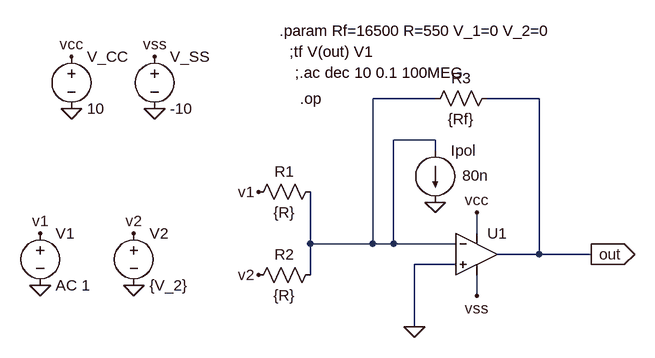
[diagram p0: schematic LAB2.asc]
LAB2.asc, the LTspice schematic file:
Version 4
SHEET 1 880 680
WIRE 336 0 240 0
WIRE 496 0 416 0
WIRE 336 64 272 64
WIRE 336 80 336 64
WIRE 400 208 400 176
WIRE 144 224 144 144
WIRE 240 224 240 0
WIRE 240 224 144 224
WIRE 272 224 272 64
WIRE 272 224 240 224
WIRE 368 224 272 224
WIRE 496 240 496 0
WIRE 496 240 432 240
WIRE 576 240 496 240
WIRE 368 256 304 256
WIRE 144 272 144 224
WIRE 400 304 400 272
WIRE 304 352 304 256
FLAG -272 288 0
FLAG -128 288 0
FLAG -224 16 0
FLAG -96 16 0
FLAG -224 -64 vcc
FLAG 400 176 vcc
FLAG -96 -64 vss
FLAG 400 304 vss
FLAG -272 208 v1
FLAG 64 144 v1
FLAG -128 208 v2
FLAG 64 272 v2
FLAG 304 352 0
FLAG 576 240 out
IOPIN 576 240 Out
FLAG 336 160 0
DATAFLAG 496 240 ""
SYMBOL res 160 128 R90
WINDOW 0 0 56 VBottom 2
WINDOW 3 32 56 VTop 2
SYMATTR InstName R1
SYMATTR Value {R}
SYMBOL res 160 256 R90
WINDOW 0 0 56 VBottom 2
WINDOW 3 32 56 VTop 2
SYMATTR InstName R2
SYMATTR Value {R}
SYMBOL res 432 -16 R90
WINDOW 0 0 56 VBottom 2
WINDOW 3 32 56 VTop 2
SYMATTR InstName R3
SYMATTR Value {Rf}
SYMBOL OpAmps\\UniversalOpamp2 400 240 R0
SYMATTR InstName U1
SYMATTR Value2 Avol=1Meg GBW=(1Meg) Slew=500k
SYMATTR SpiceLine ilimit=25m rail=0 Vos=0
SYMBOL voltage -224 -80 R0
SYMATTR InstName V_CC
SYMATTR Value 10
SYMBOL voltage -96 -80 R0
SYMATTR InstName V_SS
SYMATTR Value -10
SYMBOL voltage -272 192 R0
WINDOW 123 0 0 Left 0
WINDOW 39 0 0 Left 0
SYMATTR InstName V1
SYMATTR Value AC 1
SYMBOL voltage -128 192 R0
SYMATTR InstName V2
SYMATTR Value {V_2}
SYMBOL current 336 80 R0
WINDOW 3 42 39 Left 2
SYMATTR InstName Ipol
SYMATTR Value 80n
TEXT 96 -104 Left 2 !.param Rf=16500 R=550 V_1=0 V_2=0
TEXT 112 -72 Left 2 !;tf V(out) V1
TEXT 120 -40 Left 2 !;.ac dec 10 0.1 100MEG
TEXT 128 0 Left 2 !.op

The netlist it stands for:
* LAB2.asc
R1 N001 v1 {R}
R2 N001 v2 {R}
R3 out N001 {Rf}
XU1 0 N001 vcc vss out level.2 Avol=1Meg GBW=(1Meg) Slew=500k ilimit=25m rail=0 Vos=0 en=0 enk=0 in=0 ink=0 Rin=500Meg  ; pins IN+ IN- V+ V- OUT
V_CC vcc 0 10
V_SS vss 0 -10
V1 v1 0 AC 1
V2 v2 0 {V_2}
Ipol N001 0 80n
.param Rf=16500 R=550 V_1=0 V_2=0
;tf V(out) V1
;.ac dec 10 0.1 100MEG
.op
.lib UniversalOpamps2.sub
.backanno
.end